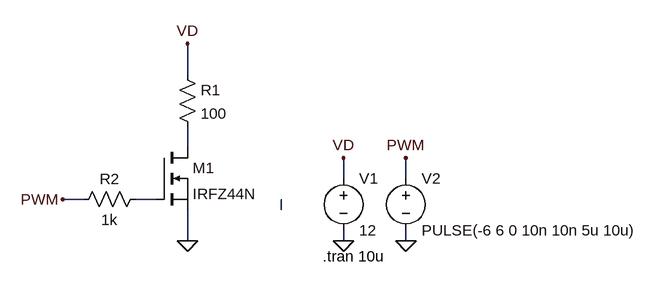
[diagram p0: schematic Low Side Driving.asc]
Low Side Driving.asc, the LTspice schematic file:
Version 4
SHEET 1 896 680
WIRE 176 -240 176 -288
WIRE 176 -128 176 -160
WIRE 416 -80 416 -112
WIRE 512 -80 512 -112
WIRE 16 -48 -16 -48
WIRE 128 -48 96 -48
WIRE 320 -32 320 -48
WIRE 176 16 176 -32
WIRE 416 16 416 0
WIRE 512 16 512 0
FLAG 416 16 0
FLAG 416 -112 VD
FLAG 512 16 0
FLAG 512 -112 PWM
FLAG 176 16 0
FLAG 176 -288 VD
FLAG -16 -48 PWM
SYMBOL voltage 416 -96 R0
WINDOW 123 0 0 Left 0
WINDOW 39 0 0 Left 0
SYMATTR InstName V1
SYMATTR Value 12
SYMBOL nmos 128 -128 R0
SYMATTR InstName M1
SYMATTR Value IRFZ44N
SYMBOL voltage 512 -96 R0
WINDOW 123 0 0 Left 0
WINDOW 39 0 0 Left 0
SYMATTR InstName V2
SYMATTR Value PULSE(-6 6 0 10n 10n 5u 10u)
SYMBOL res 160 -256 R0
SYMATTR InstName R1
SYMATTR Value 100
SYMBOL res 112 -64 R90
WINDOW 0 0 56 VBottom 2
WINDOW 3 32 56 VTop 2
SYMATTR InstName R2
SYMATTR Value 1k
TEXT 384 40 Left 2 !.tran 10u

The netlist it stands for:
* Low Side Driving.asc
V1 VD 0 12
M1 N001 N002 0 0 IRFZ44N
V2 PWM 0 PULSE(-6 6 0 10n 10n 5u 10u)
R1 VD N001 100
R2 N002 PWM 1k
.model NMOS NMOS
.model PMOS PMOS
.lib standard.mos
.tran 10u
.backanno
.end